# Altium schematic sheet panel.SchDoc
size A; SheetNumber: 8; SheetTotal: 8
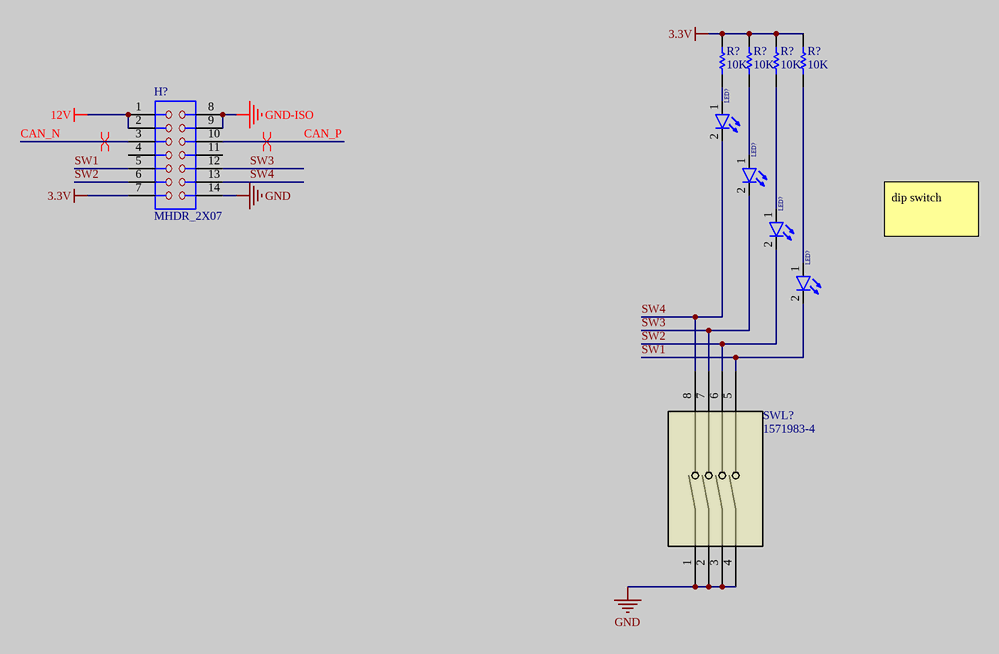
[diagram p0: panel.SchDoc]

## Parts
(Parts that share a designator on the sheet are numbered #1, #2 ... from top to bottom, then left to right.)
H?  MHDR_2X07  [miniATX 2 × 7]
LED?#1  Red  [led]  (value not drawn)
LED?#2  Red  [led]  (value not drawn)
LED?#3  Red  [led]  (value not drawn)
LED?#4  Red  [led]  (value not drawn)
R?#1  10K  [RESC0603]
R?#2  10K  [RESC0603]
R?#3  10K  [RESC0603]
R?#4  10K  [RESC0603]
SWL?  1571983-4  [SW4_1571983_4P_TEC]

## Nets
3.3V: H?.7 R?#1.2 R?#2.2 R?#3.2 R?#4.2
12V: H?.1 H?.2
GND: H?.14 SWL?.1 SWL?.2 SWL?.3 SWL?.4
GND-ISO: H?.8 H?.9
CAN_N: H?.3
CAN_P: H?.10
SW1: H?.5 LED?#4.2(K) SWL?.5
SW2: H?.6 LED?#3.2(K) SWL?.6
SW3: H?.12 LED?#2.2(K) SWL?.7
SW4: H?.13 LED?#1.2(K) SWL?.8
NetLED?#1_1: LED?#1.1(A) R?#1.1
NetLED?#2_1: LED?#2.1(A) R?#2.1
NetLED?#3_1: LED?#3.1(A) R?#3.1
NetLED?#4_1: LED?#4.1(A) R?#4.1

Not connected (* = marked no-connect by the designer): H? 4 11

## Layout directives
differential pair: CAN_N, CAN_P

## Notes on the sheet
- dip switch

## Library data of the parts
H? = HDR_mini_2 × 7: Male Header 2X07
LED?#1-LED?#4 = LED: Designer: Saeid Jorablo; Organazation: ControTec; Adding Date: 1387/12/22; Color: Red; Size: SMD 0603
R?#1-R?#4 = Resistor: 0603,0.1W; Published: 8-Jun-2000; LatestRevisionDate: 17-Jul-2002; LatestRevisionNote: Re-released for DXP Platform.; PackageReference: AXIAL-0.5; Publisher: Altium Limited; Value: 10K
SWL? = 1571983-4: GDH04S04=DIP SWITCH; Manufacturer_Name: TE Connectivity; Copyright: Copyright (C) 2025 Ultra Librarian. All rights reserved.; Manufacturer_Part_Number: 1571983-4; RefDes: RefDes; Type: Type